# EAGLE design sclift_esp (EAGLE 8.1.0)

## Sheet 1 of 3
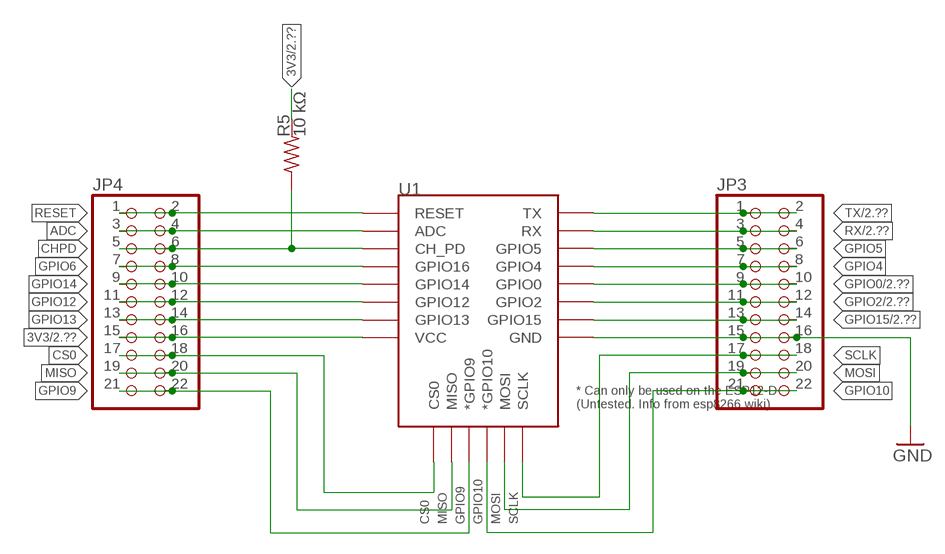
[diagram p0: schematic, sheet 1]

### Parts
JP3  PINHD-2X11  [2X11]
JP4  PINHD-2X11  [2X11]
R5  10 kΩ  R-US_0204/7  [0204/7]
U1  ESP12ESMD  [ESP12E-SMD]

### Nets
3V3: JP4.15 JP4.16 R5.2 U1.VCC ; also sheet 2,3
ADC: JP4.3 JP4.4 U1.ADC
CHPD: JP4.5 JP4.6 R5.1 U1.CH_PD
CS0: JP4.17 JP4.18 U1.CS0
GND: JP3.15 JP3.16 U1.GND ; also sheet 2,3
GPIO0: JP3.9 JP3.10 U1.GPIO0 ; also sheet 2
GPIO2: JP3.11 JP3.12 U1.GPIO2 ; also sheet 2
GPIO4: JP3.7 JP3.8 U1.GPIO4
GPIO5: JP3.5 JP3.6 U1.GPIO5
GPIO6: JP4.7 JP4.8 U1.GPIO16
GPIO9: JP4.21 JP4.22 U1.GPIO9(*GPIO9)
GPIO10: JP3.21 JP3.22 U1.GPIO10(*GPIO10)
GPIO12: JP4.11 JP4.12 U1.GPIO12
GPIO13: JP4.13 JP4.14 U1.GPIO13
GPIO14: JP4.9 JP4.10 U1.GPIO14
GPIO15: JP3.13 JP3.14 U1.GPIO15 ; also sheet 2
MISO: JP4.19 JP4.20 U1.MISO
MOSI: JP3.19 JP3.20 U1.MOSI
RESET: JP4.1 JP4.2 U1.RESET ; also sheet 2
RX: JP3.3 JP3.4 U1.RXD0(RX) ; also sheet 2
SCLK: JP3.17 JP3.18 U1.SCLK
TX: JP3.1 JP3.2 U1.TXD0(TX) ; also sheet 2

## Sheet 2 of 3
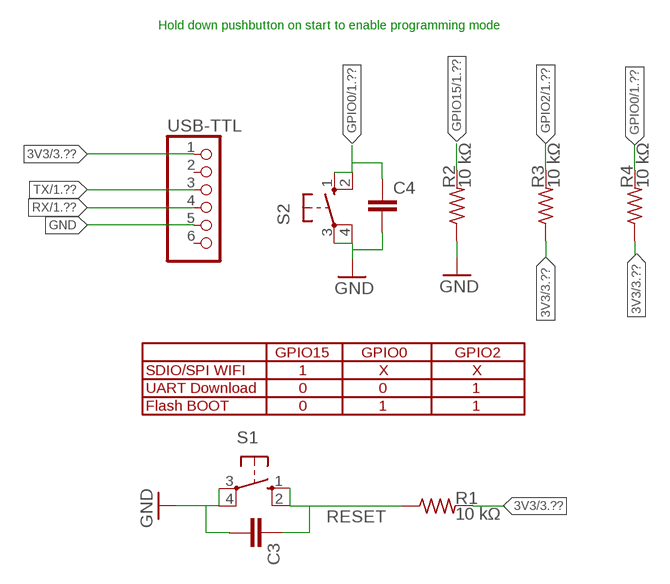
[diagram p1: schematic, sheet 2]

### Parts
C3  C-EU025-024X044  [C025-024X044]
C4  C-EU025-024X044  [C025-024X044]
R1  10 kΩ  R-US_0204/7  [0204/7]
R2  10 kΩ  R-US_0204/7  [0204/7]
R3  10 kΩ  R-US_0204/7  [0204/7]
R4  10 kΩ  R-US_0204/7  [0204/7]
S1  10-XX  [B3F-10XX]
S2  10-XX  [B3F-10XX]
USB-TTL  PINHD-1X6  [1X06]

### Nets
3V3: R1.2 R3.1 R4.1 USB-TTL.1 ; also sheet 1,3
GND: C3.2 C4.2 R2.1 S1.3(P) S1.4(P1) S2.3(P) S2.4(P1) USB-TTL.5 ; also sheet 1,3
GPIO0: C4.1 R4.2 S2.1(S) S2.2(S1) ; also sheet 1
GPIO2: R3.2 ; also sheet 1
GPIO15: R2.2 ; also sheet 1
RESET: C3.1 R1.1 S1.1(S) S1.2(S1) ; also sheet 1
RX: USB-TTL.4 ; also sheet 1
TX: USB-TTL.3 ; also sheet 1
Unconnected: USB-TTL.2 USB-TTL.6

### Notes on the sheet
- Hold down pushbutton on start to enable programming mode
- GPIO15 | GPIO0 | GPIO2
- SDIO/SPI WIFI | 1 | X | X
- UART Download | 0 | 0 | 1
- Flash BOOT | 0 | 1 | 1

## Sheet 3 of 3
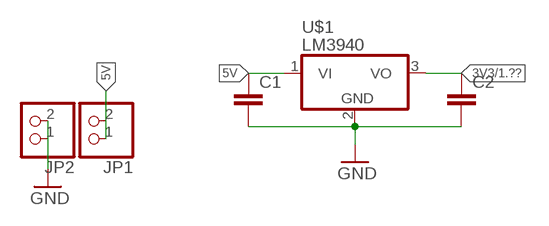
[diagram p2: schematic, sheet 3]

### Parts
C1  C-EU025-024X044  [C025-024X044]
C2  C-EU025-024X044  [C025-024X044]
JP1  PINHD-1X2  [1X02]
JP2  PINHD-1X2  [1X02]
U$1  LM3940  [TO220H]

### Nets
3V3: C2.1 U$1.3(VO) ; also sheet 1,2
5V: C1.1 JP1.1 JP1.2 U$1.1(VI)
GND: C1.2 C2.2 JP2.1 JP2.2 U$1.2(GND) ; also sheet 1,2

## Library data of the parts
C1-C4 = rcl:C-EU: CAPACITOR, European symbol
JP1 JP2 = pinhead:PINHD-1X2: PIN HEADER
JP3 JP4 = pinhead:PINHD-2X11: PIN HEADER
R1-R5 = resistor:R-US_: RESISTOR, American symbol
S1 S2 = switch-omron:10-XX: OMRON SWITCH; MPN: B3F-1000; OC_FARNELL: 176432; OC_NEWARK: 36M3542
U1 = esp8266modules:ESP12E: ESP12E Module
U$1 = lm3940:LM3940
USB-TTL = pinhead:PINHD-1X6: PIN HEADER

## Board
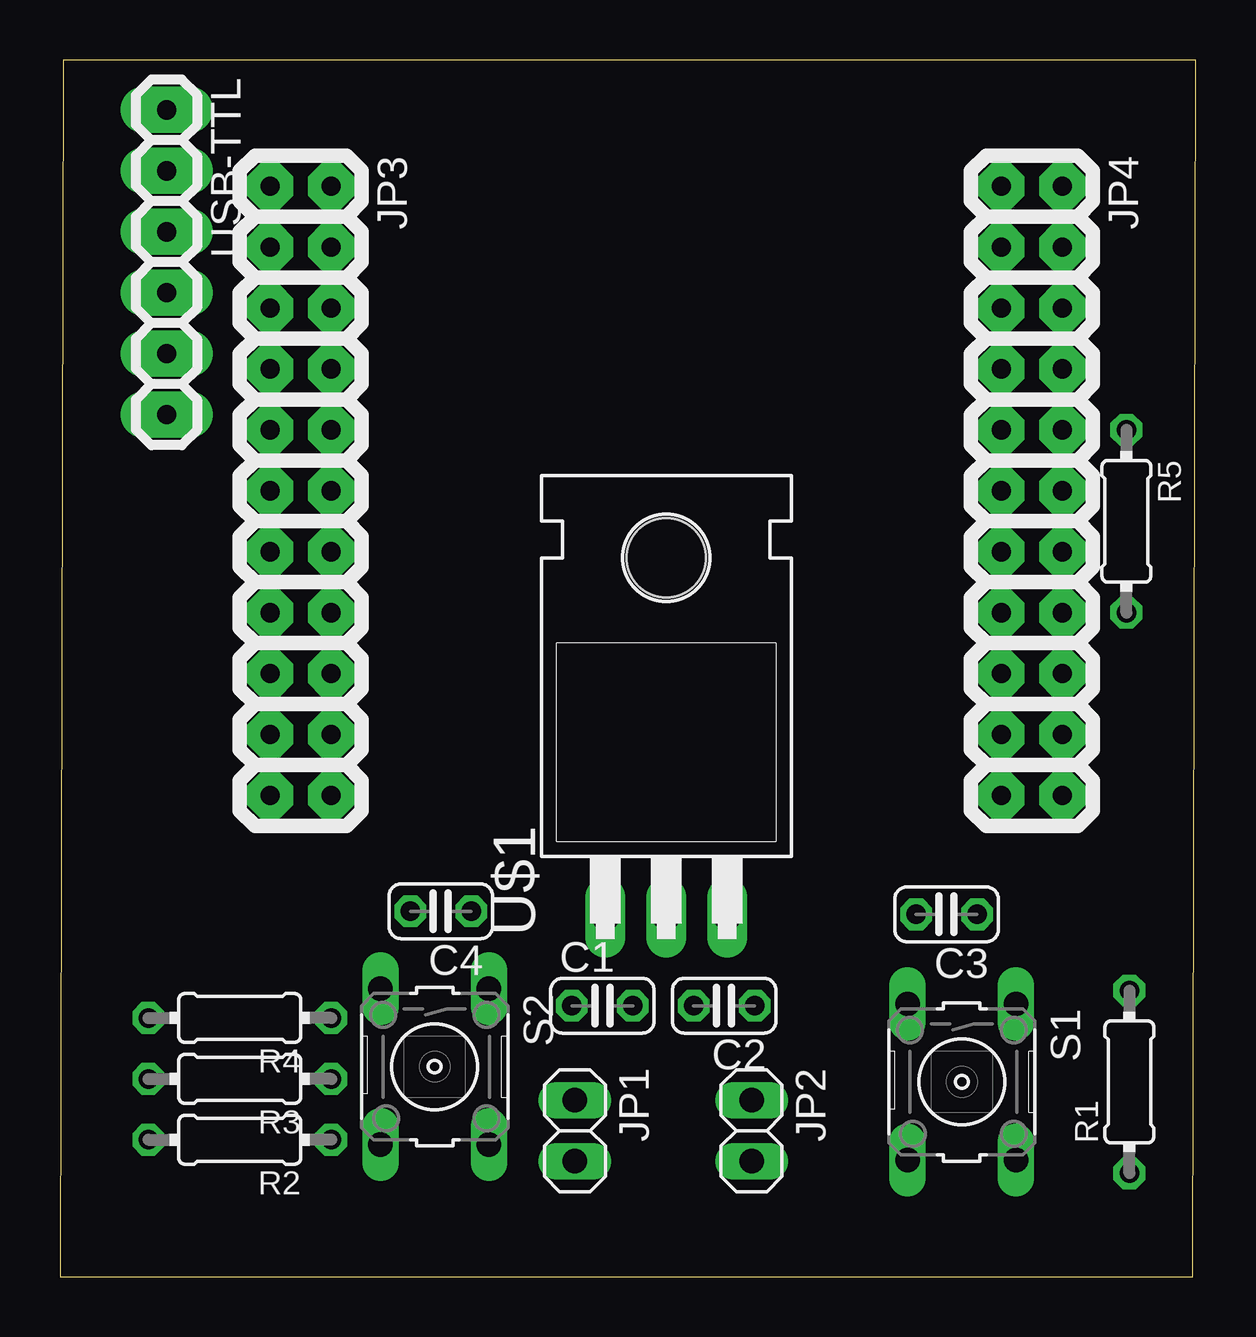
[diagram p3: board, top side]
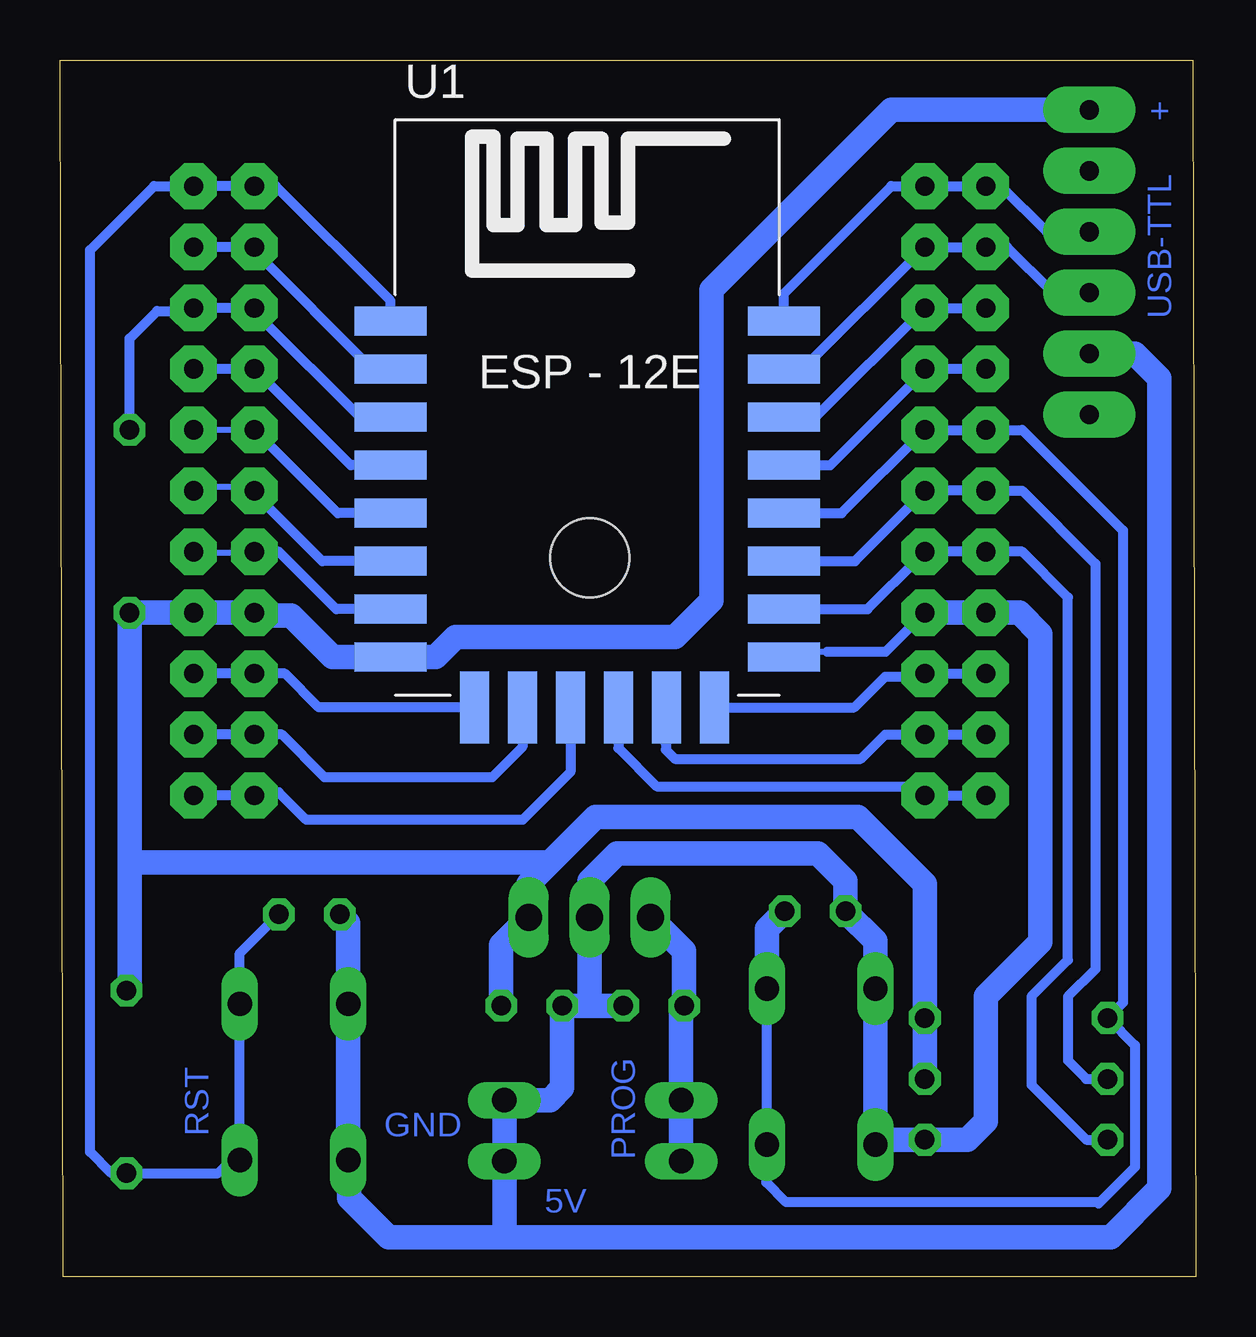
[diagram p4: board, bottom side, seen from below]

Size 47.35 x 50.72 mm. Coordinates in mm from the lower left corner, seen from the top.
Outline: 0,0 47.22,0 47.35,50.72 0.13,50.72 0,0
Copper layers (1*16): Top 0.035mm / dielectric 1.5mm / Bottom 0.035mm
Design rules "default": minimum track width 10mil, minimum drill 24mil, track to track 8mil, track to pad 8mil, pad to pad 8mil, via to via 8mil, smd to smd 8mil, copper to edge 40mil, drill to drill 8mil, minimum pad ring 10mil, minimum via ring 8mil, stop-mask expansion 4mil, vias tented up to drill 0mil, thermal gap 10mil

### Footprints (pad centres in the part's own frame; a part is rotated, then mirrored left to right if it is on the bottom)
C025-024X044 = drill 0.813 octagon: 1 -1.27,0; 2 1.27,0
1X02 = drill 1.016 long: 1 -1.27,0; 2 1.27,0
2X11 = drill 0.8 pad 1.93 octagon: 1 -12.7,-1.27; 2 -12.7,1.27; 3 -10.16,-1.27; 4 -10.16,1.27; 5 -7.62,-1.27; 6 -7.62,1.27; 7 -5.08,-1.27; 8 -5.08,1.27; 9 -2.54,-1.27; 10 -2.54,1.27; 11 0,-1.27; 12 0,1.27; 13 2.54,-1.27; 14 2.54,1.27; 15 5.08,-1.27; 16 5.08,1.27; 17 7.62,-1.27; 18 7.62,1.27; 19 10.16,-1.27; 20 10.16,1.27; 21 12.7,-1.27; 22 12.7,1.27
0204/7 = drill 0.813 octagon: 1 -3.81,0; 2 3.81,0
B3F-10XX = drill 1.016 long: 1 -3.251,2.261; 2 3.251,2.261; 3 -3.251,-2.261; 4 3.251,-2.261
ESP12E-SMD = smd 3 x 1.2: ADC -8.3,3.8; CH_PD -8.3,1.8; GND 8.1,-8.2; GPIO0 8.1,-2.2; GPIO2 8.1,-4.2; GPIO4 8.1,-0.2; GPIO5 8.1,1.8; GPIO12 -8.3,-4.2; GPIO13 -8.3,-6.2; GPIO14 -8.3,-2.2; GPIO15 8.1,-6.2; GPIO16 -8.3,-0.2; RESET -8.3,5.8; RXD0 8.1,3.8; TXD0 8.1,5.8; VCC -8.3,-8.2 | smd 1.2 x 3: CS0 -4.8,-10.3; GPIO9 -0.8,-10.3; GPIO10 1.2,-10.3; MISO -2.8,-10.3; MOSI 3.2,-10.3; SCLK 5.2,-10.3
TO220H = drill 1.118 long: 1 -2.54,-10.16; 2 0,-10.16; 3 2.54,-10.16 | hole 3.302: 0,4.826
1X06 = drill 0.8 pad 1.93 long: 1 -6.35,0; 2 -3.81,0; 3 -1.27,0; 4 1.27,0; 5 3.81,0; 6 6.35,0

### Placement (x,y rotation side)
C1  22.61,11.3 0 top
C2  27.69,11.3 180 top
C3  36.96,15.11 180 top
C4  15.88,15.24 180 top
JP1  21.46,6.1 270 top
JP2  28.83,6.1 270 top
JP3  10.03,32.77 270 top
JP4  40.51,32.77 270 top
R1  44.58,8.13 90 top
R2  7.49,5.71 180 top
R3  7.49,8.26 180 top
R4  7.49,10.79 180 top
R5  44.45,31.5 270 top
S1  37.59,8.13 270 top
S2  15.62,8.76 270 top
U1  25.27,34.04 0 bottom
U$1  25.27,25.15 0 top
USB-TTL  4.44,42.29 270 top

### Tracks (layer width: path | path; a pad name or v marks a point on that pad's centre or on a via)
3V3
  Bottom 1.016: 32.89,25.84 31.7,25.84 30.86,26.67 21.72,26.67 20.19,28.19 20.19,41.15 12.7,48.64 USB-TTL.1 | 32.89,25.84 U1.VCC 36,25.84 37.72,27.56 39.12,27.56 JP4.15 JP4.16 R5.2 44.45,17.27 | 34.42,25.91 32.96,25.91 32.89,25.84 | 26.99,17.21 25.02,19.18 14.1,19.18 11.3,16.38 R4.1 R3.1 | 26.99,17.21 27.81,16.38 U$1.3 28.96,13.84 C2.1 | R1.2 44.45,12.06 44.45,17.27 | 26.99,17.21 27.05,17.27 44.45,17.27
5V
  Bottom 1.016: JP1.2 JP1.1 21.46,11.18 C1.1 21.34,13.59 U$1.1
ADC
  Bottom 0.254: 39.24,42.75 JP4.3
  Bottom 0.406: JP4.3 JP4.4 | U1.ADC 34.33,37.84 39.24,42.75
CHPD
  Bottom 0.254: 39,39.99 39.24,40.23 JP4.5
  Bottom 0.406: JP4.5 JP4.6 41.91,40.26 43.31,40.26 44.45,39.12 R5.1 | U1.CH_PD 34.84,35.84 39,39.99
CS0
  Bottom 0.406: JP4.18 JP4.17 37.97,25.15 36.56,23.74 U1.CS0
GND
  Bottom 0.254: 35.31,11.38 S1.3 | 15.37,26.06 17.07,26.06 U1.GND
  Bottom 0.406: 15.37,26.06 12.93,26.06 JP3.16
  Bottom 1.016: C3.2 35.33,14.76 S1.3 S1.4 35.31,4.85 35.31,3.3 33.66,1.65 28.83,1.65 | 25.4,11.3 C2.2 26.42,7.87 26.92,7.37 JP2.1 JP2.2 28.83,1.65 | 25.4,11.3 C1.2 | JP3.16 JP3.15 7.37,27.69 6.48,26.8 6.48,13.97 8.76,11.68 8.76,6.48 9.53,5.71 R2.1 13.16,5.71 S2.4 S2.3 13.36,13.99 C4.2 14.61,16.51 15.75,17.65 24.13,17.65 25.27,16.51 U$1.2 25.27,11.43 25.4,11.3 | USB-TTL.5 2.54,38.48 1.52,37.47 1.52,3.68 3.56,1.65 28.83,1.65
GPIO0
  Bottom 0.406: S2.1 S2.2 17.91,5.49 17.91,3.94 17.08,3.11 4,3.11 | R4.2 3.94,11.05 | R4.2 2.54,9.65 2.54,4.57 4,3.11 | R4.2 3.56,10.92 | R4.2 3.05,11.43 3.05,31.11 7.24,35.31 JP3.9 JP3.10 14.77,31.84 U1.GPIO0 | 4,3.11 4.06,3.05
  Bottom 1.016: S2.1 17.88,14.5 C4.1
GPIO2
  Bottom 0.254: 11.61,32.44 11.35,32.69 JP3.12
  Bottom 0.406: JP3.12 JP3.11 7.24,32.77 4.19,29.72 4.19,12.83 5.33,11.68 5.33,9.02 4.57,8.26 R3.2 | U1.GPIO2 14.21,29.84 11.61,32.44
GPIO4
  Bottom 0.254: 11.58,37.49 11.35,37.72 JP3.8
  Bottom 0.406: JP3.7 JP3.8 | U1.GPIO4 15.24,33.84 11.58,37.49
GPIO5
  Bottom 0.406: JP3.5 JP3.6 15.85,35.84 U1.GPIO5
GPIO6
  Bottom 0.406: JP4.8 JP4.7 35.23,33.84 U1.GPIO16
GPIO9
  Bottom 0.406: JP4.22 JP4.21 39.12,20.19 38.23,20.19 37.08,19.05 28.07,19.05 26.07,21.04 U1.GPIO9
GPIO10
  Bottom 0.406: U1.GPIO10 24.07,22.04 22.48,20.45 11.68,20.45 JP3.22 JP3.21
GPIO12
  Bottom 0.254: U1.GPIO12 33.76,29.95 36.5,29.95 39.24,32.69 JP4.11 39.24,32.92 39.5,32.92 41.76,32.92 JP4.12
  Bottom 0.406: U1.GPIO12 36.41,29.84 39.5,32.92
GPIO13
  Bottom 0.254: 33.76,27.89 U1.GPIO13 | 39.24,30.4 JP4.13 39.24,30.18 39.75,30.18 41.76,30.18 JP4.14
  Bottom 0.406: U1.GPIO13 35.84,27.84 38.23,30.23 39.7,30.23 39.75,30.18
GPIO14
  Bottom 0.254: JP4.9 JP4.10
  Bottom 0.406: U1.GPIO14 35.77,31.84 JP4.9
GPIO15
  Bottom 0.254: 11.56,29.97 JP3.14
  Bottom 0.406: JP3.14 JP3.13 7.24,30.23 5.33,28.32 5.33,13.21 6.86,11.68 6.86,8 4.57,5.71 R2.2 | U1.GPIO15 13.69,27.84 11.56,29.97
MISO
  Bottom 0.406: JP4.20 JP4.19 38.1,22.61 36.32,20.83 29.34,20.83 28.07,22.09 U1.MISO
MOSI
  Bottom 0.406: U1.MOSI 22.07,22.25 22.1,22.23 22.1,21.97 21.72,21.59 13.97,21.59 12.95,22.61 JP3.20 JP3.19
RESET
  Bottom 0.254: 33.76,40.01 U1.RESET | 39.24,45.49 JP4.1
  Bottom 0.406: C3.1 39.85,13.49 S1.1 S1.2 40.21,4.88 40.77,4.32 R1.1 45.21,4.32 46.1,5.21 46.1,42.8 43.43,45.47 JP4.2 JP4.1 38.35,45.47 33.57,40.69 U1.RESET
RX
  Bottom 0.406: USB-TTL.4 5.97,41.02 7.87,42.93 JP3.3 JP3.4 16.39,37.84 U1.RXD0
SCLK
  Bottom 0.406: JP3.17 JP3.18 11.43,25.02 12.95,25.02 14.24,23.74 U1.SCLK
TX
  Bottom 0.254: 16.61,40.01 17.07,40.01 U1.TXD0 | 11.35,45.26 JP3.2
  Bottom 0.406: USB-TTL.3 6.22,43.56 8.13,45.47 JP3.1 JP3.2 12.7,45.47 17.17,40.99 U1.TXD0

### Text on the board
Bottom: + | USB-TTL | PROG | RST | GND | 5V